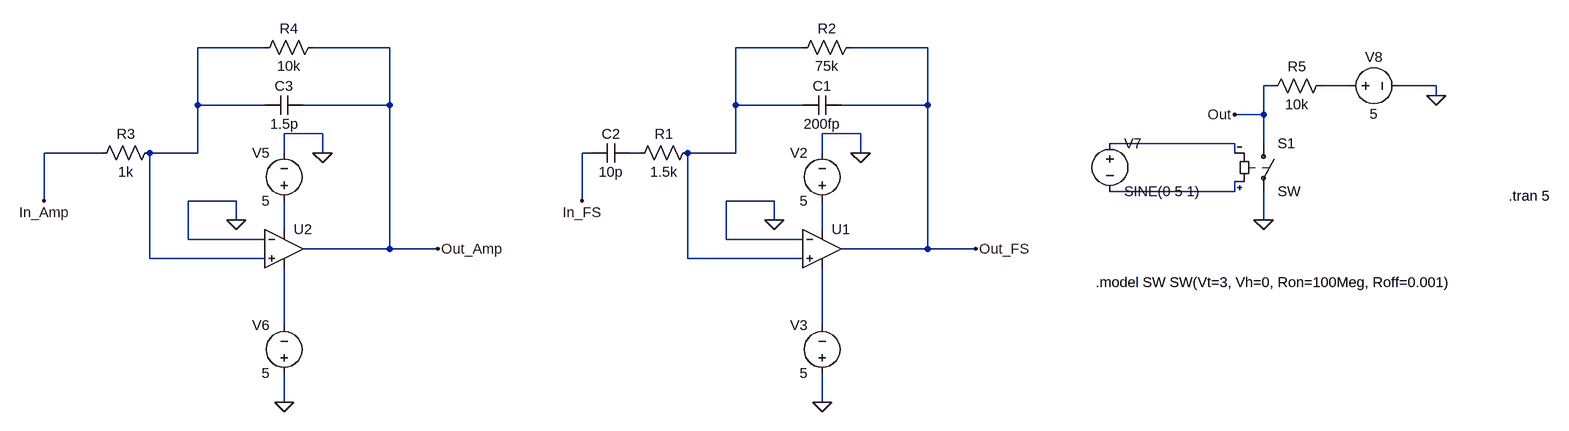
[diagram p0: schematic full_electronic_v1.asc]
full_electronic_v1.asc, the LTspice schematic file:
Version 4
SHEET 1 1976 680
WIRE -1200 -944 -1312 -944
WIRE -992 -944 -1120 -944
WIRE 0 -944 -112 -944
WIRE 208 -944 80 -944
WIRE 1152 -880 1136 -880
WIRE 1280 -880 1232 -880
WIRE 1424 -880 1360 -880
WIRE 1424 -864 1424 -880
WIRE -1312 -848 -1312 -944
WIRE -1200 -848 -1312 -848
WIRE -992 -848 -992 -944
WIRE -992 -848 -1136 -848
WIRE -112 -848 -112 -944
WIRE 0 -848 -112 -848
WIRE 208 -848 208 -944
WIRE 208 -848 64 -848
WIRE 1136 -832 1136 -880
WIRE 1136 -832 1088 -832
WIRE -1104 -800 -1168 -800
WIRE 96 -800 32 -800
WIRE 1088 -784 880 -784
WIRE 1136 -784 1136 -832
WIRE -1472 -768 -1568 -768
WIRE -1312 -768 -1312 -848
WIRE -1312 -768 -1392 -768
WIRE -1168 -768 -1168 -800
WIRE -1104 -768 -1104 -800
WIRE -352 -768 -368 -768
WIRE -272 -768 -288 -768
WIRE -112 -768 -112 -848
WIRE -112 -768 -192 -768
WIRE 32 -768 32 -800
WIRE 96 -768 96 -800
WIRE 1088 -768 1088 -784
WIRE 1088 -704 1088 -720
WIRE 1088 -704 880 -704
WIRE -1568 -688 -1568 -768
WIRE -1248 -688 -1328 -688
WIRE -368 -688 -368 -768
WIRE -48 -688 -128 -688
WIRE -1248 -656 -1248 -688
WIRE -48 -656 -48 -688
WIRE 1136 -656 1136 -704
WIRE -1168 -640 -1168 -688
WIRE 32 -640 32 -688
WIRE -1328 -624 -1328 -688
WIRE -1200 -624 -1328 -624
WIRE -128 -624 -128 -688
WIRE 0 -624 -128 -624
WIRE -992 -608 -992 -848
WIRE -992 -608 -1136 -608
WIRE -912 -608 -992 -608
WIRE 208 -608 208 -848
WIRE 208 -608 64 -608
WIRE 288 -608 208 -608
WIRE -1392 -592 -1392 -768
WIRE -1200 -592 -1392 -592
WIRE -192 -592 -192 -768
WIRE 0 -592 -192 -592
WIRE -1168 -480 -1168 -576
WIRE 32 -480 32 -576
WIRE -1168 -352 -1168 -400
WIRE 32 -352 32 -400
FLAG 32 -352 0
FLAG 96 -768 0
FLAG -48 -656 0
FLAG -1168 -352 0
FLAG -1104 -768 0
FLAG -1248 -656 0
FLAG 1136 -656 0
FLAG 1424 -864 0
FLAG 1088 -832 Out
FLAG -1568 -688 In_Amp
FLAG -912 -608 Out_Amp
FLAG -368 -688 In_FS
FLAG 288 -608 Out_FS
SYMBOL res -176 -784 R90
WINDOW 0 0 56 VBottom 2
WINDOW 3 32 56 VTop 2
SYMATTR InstName R1
SYMATTR Value 1.5k
SYMBOL res 96 -960 R90
WINDOW 0 0 56 VBottom 2
WINDOW 3 32 56 VTop 2
SYMATTR InstName R2
SYMATTR Value 75k
SYMBOL voltage 32 -672 R180
WINDOW 0 24 96 Left 2
WINDOW 3 24 16 Left 2
WINDOW 123 0 0 Left 0
WINDOW 39 0 0 Left 0
SYMATTR InstName V2
SYMATTR Value 5
SYMBOL voltage 32 -384 R180
WINDOW 0 24 96 Left 2
WINDOW 3 24 16 Left 2
WINDOW 123 0 0 Left 0
WINDOW 39 0 0 Left 0
SYMATTR InstName V3
SYMATTR Value 5
SYMBOL OpAmps\\UniversalOpAmp1 32 -608 R0
SYMATTR InstName U1
SYMATTR Value2 Avol=1Meg GBW=100Meg Vos=0
SYMBOL cap 64 -864 R90
WINDOW 0 0 32 VBottom 2
WINDOW 3 32 32 VTop 2
SYMATTR InstName C1
SYMATTR Value 200fp
SYMBOL cap -288 -784 R90
WINDOW 0 0 32 VBottom 2
WINDOW 3 32 32 VTop 2
SYMATTR InstName C2
SYMATTR Value 10p
SYMBOL res -1376 -784 R90
WINDOW 0 0 56 VBottom 2
WINDOW 3 32 56 VTop 2
SYMATTR InstName R3
SYMATTR Value 1k
SYMBOL res -1104 -960 R90
WINDOW 0 0 56 VBottom 2
WINDOW 3 32 56 VTop 2
SYMATTR InstName R4
SYMATTR Value 10k
SYMBOL voltage -1168 -672 R180
WINDOW 0 24 96 Left 2
WINDOW 3 24 16 Left 2
WINDOW 123 0 0 Left 0
WINDOW 39 0 0 Left 0
SYMATTR InstName V5
SYMATTR Value 5
SYMBOL voltage -1168 -384 R180
WINDOW 0 24 96 Left 2
WINDOW 3 24 16 Left 2
WINDOW 123 0 0 Left 0
WINDOW 39 0 0 Left 0
SYMATTR InstName V6
SYMATTR Value 5
SYMBOL OpAmps\\UniversalOpAmp1 -1168 -608 R0
SYMATTR InstName U2
SYMATTR Value2 Avol=1Meg GBW=70Meg Vos=0
SYMBOL cap -1136 -864 R90
WINDOW 0 0 32 VBottom 2
WINDOW 3 32 32 VTop 2
SYMATTR InstName C3
SYMATTR Value 1.5p
SYMBOL sw 1136 -800 R0
SYMATTR InstName S1
SYMBOL voltage 880 -800 R0
WINDOW 123 0 0 Left 0
WINDOW 39 0 0 Left 0
SYMATTR InstName V7
SYMATTR Value SINE(0 5 1)
SYMBOL voltage 1264 -880 R270
WINDOW 0 32 56 VTop 2
WINDOW 3 -32 56 VBottom 2
SYMATTR InstName V8
SYMATTR Value 5
SYMBOL res 1248 -896 R90
WINDOW 0 0 56 VBottom 2
WINDOW 3 32 56 VTop 2
SYMATTR InstName R5
SYMATTR Value 10k
TEXT 856 -552 Left 2 !.model SW SW(Vt=3, Vh=0, Ron=100Meg, Roff=0.001)
TEXT 1896 -696 Left 2 !.tran 5

The netlist it stands for:
* full_electronic_v1.asc
R1 N002 N005 1.5k
R2 Out_FS N002 75k
V2 N008 0 5
V3 0 N010 5
XU1 N002 0 N008 N010 Out_FS level1 Avol=1Meg GBW=100Meg Vos=0 En=0 Enk=0 In=0 Ink=0 Rin=500Meg  ; pins In+ In- V+ V- OUT
C1 Out_FS N002 200fp
C2 N005 In_FS 10p
R3 N001 In_Amp 1k
R4 Out_Amp N001 10k
V5 N007 0 5
V6 0 N009 5
XU2 N001 0 N007 N009 Out_Amp level1 Avol=1Meg GBW=70Meg Vos=0 En=0 Enk=0 In=0 Ink=0 Rin=500Meg  ; pins In+ In- V+ V- OUT
C3 Out_Amp N001 1.5p
S1 Out 0 N006 N004 SW
V7 N004 N006 SINE(0 5 1)
V8 N003 0 5
R5 N003 Out 10k
.model SW SW(Vt=3, Vh=0, Ron=100Meg, Roff=0.001)
.tran 5
.lib UniversalOpAmp1.lib
.backanno
.end